# Altium project Simple_EEM_Controller.PrjPCB (part 3 of 5)

## Sheet Connector_SOM240_1.SchDoc: =SheetTitle_Top
size 420 x 297 mm; EDA_Number: ARTIQ; Projet: Simple EEM Controller; Author: G.Kasprowicz; CompanyName: WUT ISE; DrawnBy: G.Kasprowicz; Organization: WUT ISE; Address1: PW ISE; Address2: Nowowiejska 15/19 00-665 Warsaw; Address3: gkasprow@gmail.com; Revision: 1.0; ModifiedBy: -; CheckedDate: -; Title2: K24/K26 SOM240_1 Connector; DivGrp: WUT ISE; Designer: G.Kasprowicz; ModifiedDate: -; ProjectName: Sensor Box
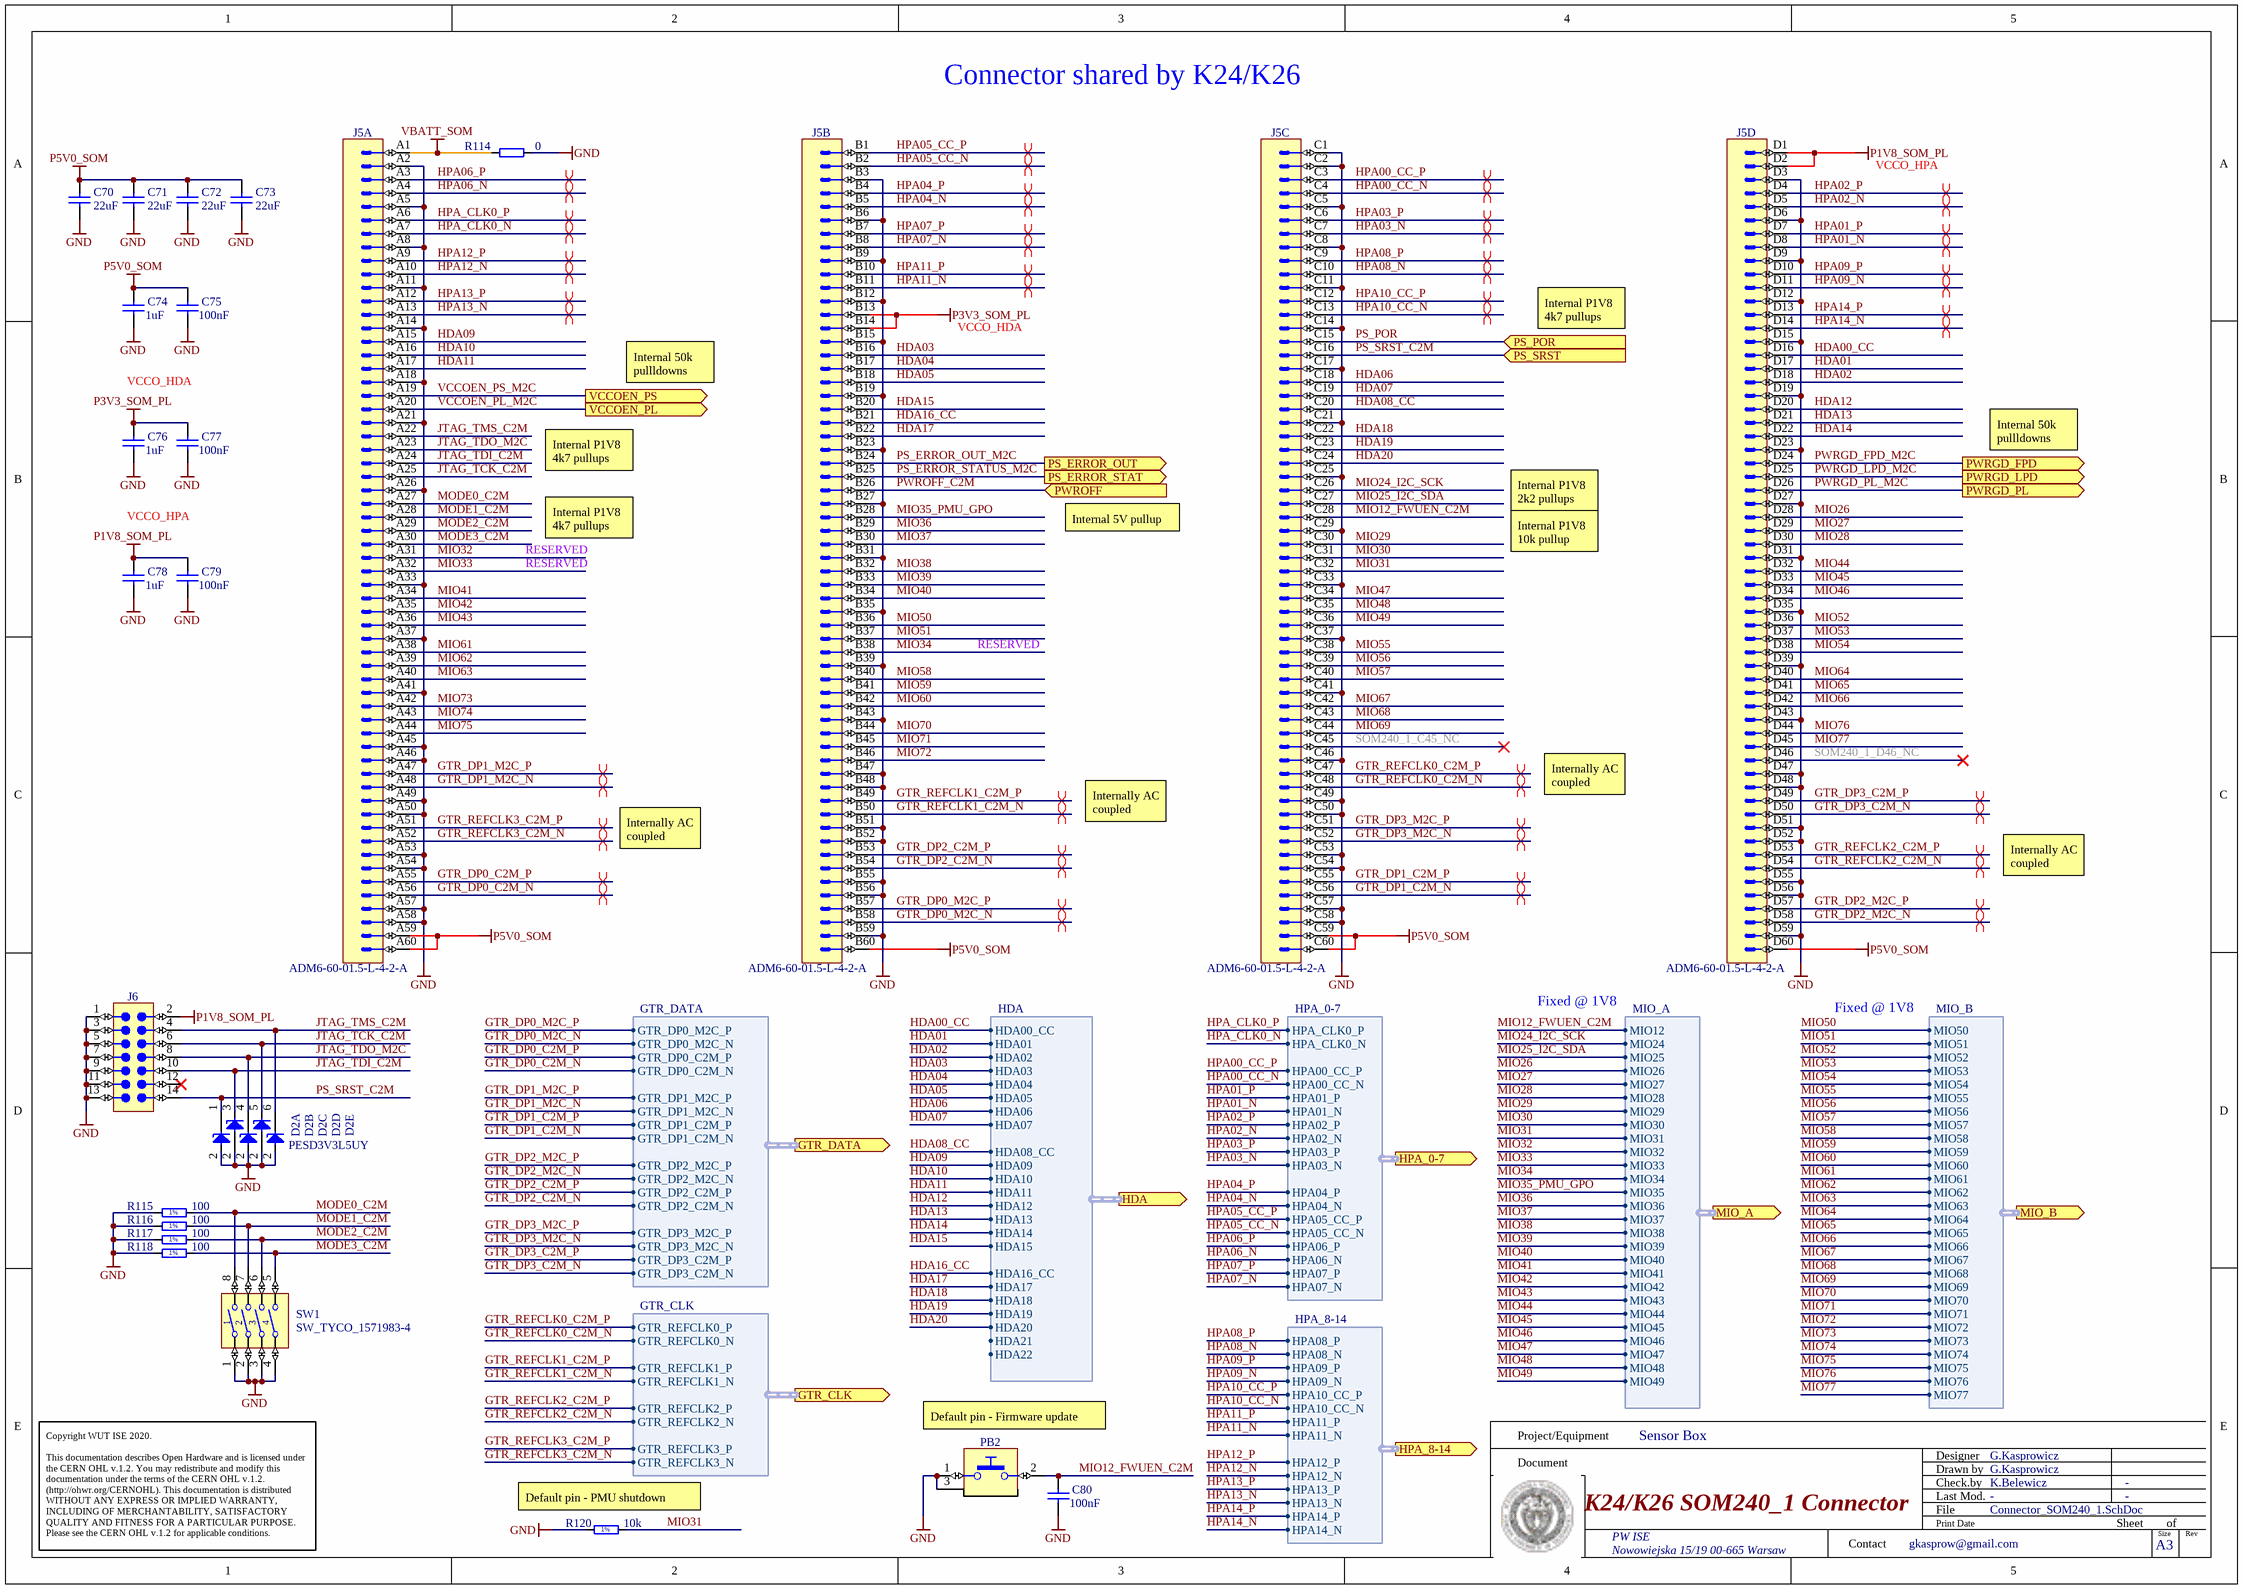
[diagram p5: Connector_SOM240_1.SchDoc]

### Parts
C70  22uF  [CAPC2012X135N]
C71  22uF  [CAPC2012X135N]
C72  22uF  [CAPC2012X135N]
C73  22uF  [CAPC2012X135N]
C74  1uF  [CAPC1005X55N]
C75  100nF  [CAPC1005X55N]
C76  1uF  [CAPC1005X55N]
C77  100nF  [CAPC1005X55N]
C78  1uF  [CAPC1005X55N]
C79  100nF  [CAPC1005X55N]
C80  100nF  [CAPC1005X55N]
D2  PESD3V3L5UY  [SOT65P210X110-6N]  (value not drawn)  (parts A,B,C,D,E of 5)
J5  Manufacturer Part Number: ADM6-60-01.5-L-4-2-A  [SAMTEC_ADM6-60-01.5-L-4-2-A]  (hidden comment: Header 240)  (parts A,B,C,D of 4)
J6  (no value)  [MOLEX_87832-1420]
PB2  (no value)  [PB_OMRON_B3U-1100P]
R114  0  [RESC1005X40N]
R115  100  [RESC1005X40N]
R116  100  [RESC1005X40N]
R117  100  [RESC1005X40N]
R118  100  [RESC1005X40N]
R120  10k  [RESC1005X40N]
SW1  Switch  [SW_TYCO_1571983-4]  (value not drawn)

### Ports
GTR_CLK (out, harness GTR_CLK), GTR_DATA (out, harness GTR_DATA), HDA (out, harness HDA), HPA_0-7 (out, harness HPA_0-7), HPA_8-14 (out, harness HPA_8-14), MIO_A (out, harness MIO_A), MIO_B (out, harness MIO_B), PS_ERROR_OUT (out), PS_ERROR_STAT (out), PS_POR (in), PS_SRST (in), PWRGD_FPD (out), PWRGD_LPD (out), PWRGD_PL (out), PWROFF (in), VCCOEN_PL (out), VCCOEN_PS (out)

### Harnesses
GTR_DATA: GTR_DP0_M2C_P, GTR_DP0_M2C_N, GTR_DP0_C2M_P, GTR_DP0_C2M_N, GTR_DP1_M2C_P, GTR_DP1_M2C_N, GTR_DP1_C2M_P, GTR_DP1_C2M_N, GTR_DP2_M2C_P, GTR_DP2_M2C_N, GTR_DP2_C2M_P, GTR_DP2_C2M_N, GTR_DP3_M2C_P, GTR_DP3_M2C_N, GTR_DP3_C2M_P, GTR_DP3_C2M_N
GTR_CLK: GTR_REFCLK0_P, GTR_REFCLK0_N, GTR_REFCLK1_P, GTR_REFCLK1_N, GTR_REFCLK2_P, GTR_REFCLK2_N, GTR_REFCLK3_P, GTR_REFCLK3_N
HDA: HDA00_CC, HDA01, HDA02, HDA03, HDA04, HDA06, HDA07, HDA05, HDA08_CC, HDA09, HDA10, HDA11, HDA12, HDA13, HDA14, HDA15, HDA16_CC, HDA17, HDA18, HDA19, HDA20, HDA21, HDA22
HPA_0-7: HPA_CLK0_P, HPA_CLK0_N, HPA00_CC_P, HPA00_CC_N, HPA01_P, HPA01_N, HPA02_P, HPA02_N, HPA03_P, HPA03_N, HPA04_P, HPA04_N, HPA05_CC_P, HPA05_CC_N, HPA06_P, HPA06_N, HPA07_P, HPA07_N
HPA_8-14: HPA08_P, HPA08_N, HPA09_P, HPA09_N, HPA10_CC_P, HPA10_CC_N, HPA11_P, HPA11_N, HPA12_P, HPA12_N, HPA13_P, HPA13_N, HPA14_P, HPA14_N
MIO_A: MIO12, MIO24, MIO25, MIO26, MIO27, MIO28, MIO29, MIO30, MIO31, MIO32, MIO33, MIO34, MIO35, MIO36, MIO37, MIO38, MIO39, MIO40, MIO41, MIO42, MIO43, MIO44, MIO45, MIO46, MIO47, MIO48, MIO49
MIO_B: MIO50, MIO51, MIO52, MIO53, MIO54, MIO55, MIO56, MIO57, MIO58, MIO59, MIO60, MIO61, MIO62, MIO63, MIO64, MIO65, MIO66, MIO67, MIO68, MIO69, MIO70, MIO71, MIO72, MIO73, MIO74, MIO75, MIO76, MIO77

### Nets
GND: C70.1 C71.1 C72.1 C73.1 C74.1 C75.1 C76.1 C77.1 C78.1 C79.1 C80.1 D2.2(A) J5.A2 J5.A5 J5.A8 J5.A11 J5.A14 J5.A18 J5.A21 J5.A26 J5.A33 J5.A37 J5.A41 J5.A45 J5.A46 J5.A49 J5.A50 J5.A53 J5.A54 J5.A57 J5.A58 J5.B3 J5.B6 J5.B9 J5.B12 J5.B15 J5.B19 J5.B23 J5.B27 J5.B31 J5.B35 J5.B39 J5.B43 J5.B47 J5.B48 J5.B51 J5.B52 J5.B55 J5.B56 J5.B59 J5.C1 J5.C2 J5.C5 J5.C8 J5.C11 J5.C14 J5.C17 J5.C21 J5.C25 J5.C29 J5.C33 J5.C37 J5.C41 J5.C46 J5.C49 J5.C50 J5.C53 J5.C54 J5.C57 J5.C58 J5.D3 J5.D6 J5.D9 J5.D12 J5.D15 J5.D19 J5.D23 J5.D27 J5.D31 J5.D35 J5.D39 J5.D43 J5.D47 J5.D48 J5.D51 J5.D52 J5.D55 J5.D56 J5.D59 J6.1 J6.3 J6.5 J6.7 J6.9 J6.11 J6.13 PB2.1 PB2.3 R114.2 R115.1 R116.1 R117.1 R118.1 R120.1 SW1.1 SW1.2 SW1.3 SW1.4
P1V8_SOM_PL: C78.2 C79.2 J5.D1 J5.D2 J6.2
P3V3_SOM_PL: C76.2 C77.2 J5.B13 J5.B14
P5V0_SOM: C70.2 C71.2 C72.2 C73.2 C74.2 C75.2 J5.A59 J5.A60 J5.B60 J5.C59 J5.C60 J5.D60
VBATT_SOM: J5.A1 R114.1
GTR_DP0_C2M_N: J5.A56 ; port GTR_DATA.GTR_DP0_C2M_N
GTR_DP0_C2M_P: J5.A55 ; port GTR_DATA.GTR_DP0_C2M_P
GTR_DP0_M2C_N: J5.B58 ; port GTR_DATA.GTR_DP0_M2C_N
GTR_DP0_M2C_P: J5.B57 ; port GTR_DATA.GTR_DP0_M2C_P
GTR_DP1_C2M_N: J5.C56 ; port GTR_DATA.GTR_DP1_C2M_N
GTR_DP1_C2M_P: J5.C55 ; port GTR_DATA.GTR_DP1_C2M_P
GTR_DP1_M2C_N: J5.A48 ; port GTR_DATA.GTR_DP1_M2C_N
GTR_DP1_M2C_P: J5.A47 ; port GTR_DATA.GTR_DP1_M2C_P
GTR_DP2_C2M_N: J5.B54 ; port GTR_DATA.GTR_DP2_C2M_N
GTR_DP2_C2M_P: J5.B53 ; port GTR_DATA.GTR_DP2_C2M_P
GTR_DP2_M2C_N: J5.D58 ; port GTR_DATA.GTR_DP2_M2C_N
GTR_DP2_M2C_P: J5.D57 ; port GTR_DATA.GTR_DP2_M2C_P
GTR_DP3_C2M_N: J5.D50 ; port GTR_DATA.GTR_DP3_C2M_N
GTR_DP3_C2M_P: J5.D49 ; port GTR_DATA.GTR_DP3_C2M_P
GTR_DP3_M2C_N: J5.C52 ; port GTR_DATA.GTR_DP3_M2C_N
GTR_DP3_M2C_P: J5.C51 ; port GTR_DATA.GTR_DP3_M2C_P
GTR_REFCLK0_C2M_N: J5.C48 ; port GTR_CLK.GTR_REFCLK0_N
GTR_REFCLK0_C2M_P: J5.C47 ; port GTR_CLK.GTR_REFCLK0_P
GTR_REFCLK1_C2M_N: J5.B50 ; port GTR_CLK.GTR_REFCLK1_N
GTR_REFCLK1_C2M_P: J5.B49 ; port GTR_CLK.GTR_REFCLK1_P
GTR_REFCLK2_C2M_N: J5.D54 ; port GTR_CLK.GTR_REFCLK2_N
GTR_REFCLK2_C2M_P: J5.D53 ; port GTR_CLK.GTR_REFCLK2_P
GTR_REFCLK3_C2M_N: J5.A52 ; port GTR_CLK.GTR_REFCLK3_N
GTR_REFCLK3_C2M_P: J5.A51 ; port GTR_CLK.GTR_REFCLK3_P
HDA00_CC: J5.D16 ; port HDA.HDA00_CC  [project net HDA.HDA00_CC]
HDA01: J5.D17 ; port HDA.HDA01  [project net HDA.HDA01]
HDA02: J5.D18 ; port HDA.HDA02  [project net HDA.HDA02]
HDA03: J5.B16 ; port HDA.HDA03  [project net HDA.HDA03]
HDA04: J5.B17 ; port HDA.HDA04  [project net HDA.HDA04]
HDA05: J5.B18 ; port HDA.HDA05  [project net HDA.HDA05]
HDA06: J5.C18 ; port HDA.HDA06  [project net HDA.HDA06]
HDA07: J5.C19 ; port HDA.HDA07  [project net HDA.HDA07]
HDA08_CC: J5.C20 ; port HDA.HDA08_CC  [project net HDA.HDA08_CC]
HDA09: J5.A15 ; port HDA.HDA09  [project net HDA.HDA09]
HDA10: J5.A16 ; port HDA.HDA10  [project net HDA.HDA10]
HDA11: J5.A17 ; port HDA.HDA11  [project net HDA.HDA11]
HDA12: J5.D20 ; port HDA.HDA12  [project net HDA.HDA12]
HDA13: J5.D21 ; port HDA.HDA13  [project net HDA.HDA13]
HDA14: J5.D22 ; port HDA.HDA14  [project net HDA.HDA14]
HDA15: J5.B20 ; port HDA.HDA15  [project net HDA.HDA15]
HDA16_CC: J5.B21 ; port HDA.HDA16_CC  [project net HDA.HDA16_CC]
HDA17: J5.B22 ; port HDA.HDA17  [project net EXT_I2C.RESET]
HDA18: J5.C22 ; port HDA.HDA18  [project net EXT_I2C.SDA]
HDA19: J5.C23 ; port HDA.HDA19  [project net EXT_I2C.SCL]
HDA20: J5.C24 ; port HDA.HDA20  [project net HDA.HDA20]
HPA00_CC_N: J5.C4 ; port HPA_0-7.HPA00_CC_N  [project net EXT0.LVDS_N0]
HPA00_CC_P: J5.C3 ; port HPA_0-7.HPA00_CC_P  [project net EXT0.LVDS_P0]
HPA01_N: J5.D8 ; port HPA_0-7.HPA01_N  [project net EXT0.LVDS_N1]
HPA01_P: J5.D7 ; port HPA_0-7.HPA01_P  [project net EXT0.LVDS_P1]
HPA02_N: J5.D5 ; port HPA_0-7.HPA02_N  [project net EXT0.LVDS_N2]
HPA02_P: J5.D4 ; port HPA_0-7.HPA02_P  [project net EXT0.LVDS_P2]
HPA03_N: J5.C7 ; port HPA_0-7.HPA03_N  [project net EXT0.LVDS_N3]
HPA03_P: J5.C6 ; port HPA_0-7.HPA03_P  [project net EXT0.LVDS_P3]
HPA04_N: J5.B5 ; port HPA_0-7.HPA04_N  [project net EXT0.LVDS_N4]
HPA04_P: J5.B4 ; port HPA_0-7.HPA04_P  [project net EXT0.LVDS_P4]
HPA05_CC_N: J5.B2 ; port HPA_0-7.HPA05_CC_N  [project net EXT0.LVDS_N5]
HPA05_CC_P: J5.B1 ; port HPA_0-7.HPA05_CC_P  [project net EXT0.LVDS_P5]
HPA06_N: J5.A4 ; port HPA_0-7.HPA06_N  [project net EXT0.LVDS_N6]
HPA06_P: J5.A3 ; port HPA_0-7.HPA06_P  [project net EXT0.LVDS_P6]
HPA07_N: J5.B8 ; port HPA_0-7.HPA07_N  [project net EXT0.LVDS_N7]
HPA07_P: J5.B7 ; port HPA_0-7.HPA07_P  [project net EXT0.LVDS_P7]
HPA08_N: J5.C10 ; port HPA_8-14.HPA08_N  [project net EXT1.LVDS_N1]
HPA08_P: J5.C9 ; port HPA_8-14.HPA08_P  [project net EXT1.LVDS_P1]
HPA09_N: J5.D11 ; port HPA_8-14.HPA09_N  [project net EXT1.LVDS_N2]
HPA09_P: J5.D10 ; port HPA_8-14.HPA09_P  [project net EXT1.LVDS_P2]
HPA10_CC_N: J5.C13 ; port HPA_8-14.HPA10_CC_N  [project net EXT1.LVDS_N0]
HPA10_CC_P: J5.C12 ; port HPA_8-14.HPA10_CC_P  [project net EXT1.LVDS_P0]
HPA11_N: J5.B11 ; port HPA_8-14.HPA11_N  [project net FPGA_CLK_OUT_N]
HPA11_P: J5.B10 ; port HPA_8-14.HPA11_P  [project net FPGA_CLK_OUT_P]
HPA12_N: J5.A10 ; port HPA_8-14.HPA12_N  [project net EXT1.LVDS_N3]
HPA12_P: J5.A9 ; port HPA_8-14.HPA12_P  [project net EXT1.LVDS_P3]
HPA13_N: J5.A13 ; port HPA_8-14.HPA13_N  [project net EXT1.LVDS_N4]
HPA13_P: J5.A12 ; port HPA_8-14.HPA13_P  [project net EXT1.LVDS_P4]
HPA14_N: J5.D14 ; port HPA_8-14.HPA14_N  [project net EXT1.LVDS_N5]
HPA14_P: J5.D13 ; port HPA_8-14.HPA14_P  [project net EXT1.LVDS_P5]
HPA_CLK0_N: J5.A7 ; port HPA_0-7.HPA_CLK0_N  [project net FPGA_PL_CLKREF_N]
HPA_CLK0_P: J5.A6 ; port HPA_0-7.HPA_CLK0_P  [project net FPGA_PL_CLKREF_P]
JTAG_TCK_C2M: D2.5(C) J5.A25 J6.6
JTAG_TDI_C2M: D2.3(C) J5.A24 J6.10
JTAG_TDO_M2C: D2.4(C) J5.A23 J6.8
JTAG_TMS_C2M: D2.6(C) J5.A22 J6.4
MIO12_FWUEN_C2M: C80.2 J5.C28 PB2.2 ; port MIO_A.MIO12
MIO24_I2C_SCK: J5.C26 ; port MIO_A.MIO24
MIO25_I2C_SDA: J5.C27 ; port MIO_A.MIO25
MIO26: J5.D28 ; port MIO_A.MIO26
MIO27: J5.D29 ; port MIO_A.MIO27
MIO28: J5.D30 ; port MIO_A.MIO28
MIO29: J5.C30 ; port MIO_A.MIO29
MIO30: J5.C31 ; port MIO_A.MIO30
MIO31: J5.C32 R120.2 ; port MIO_A.MIO31
MIO32: J5.A31 ; port MIO_A.MIO32
MIO33: J5.A32 ; port MIO_A.MIO33
MIO34: J5.B38 ; port MIO_A.MIO34
MIO35_PMU_GPO: J5.B28 ; port MIO_A.MIO35
MIO36: J5.B29 ; port MIO_A.MIO36
MIO37: J5.B30 ; port MIO_A.MIO37
MIO38: J5.B32 ; port MIO_A.MIO38
MIO39: J5.B33 ; port MIO_A.MIO39
MIO40: J5.B34 ; port MIO_A.MIO40
MIO41: J5.A34 ; port MIO_A.MIO41
MIO42: J5.A35 ; port MIO_A.MIO42
MIO43: J5.A36 ; port MIO_A.MIO43
MIO44: J5.D32 ; port MIO_A.MIO44
MIO45: J5.D33 ; port MIO_A.MIO45
MIO46: J5.D34 ; port MIO_A.MIO46
MIO47: J5.C34 ; port MIO_A.MIO47
MIO48: J5.C35 ; port MIO_A.MIO48
MIO49: J5.C36 ; port MIO_A.MIO49
MIO50: J5.B36 ; port MIO_B.MIO50
MIO51: J5.B37 ; port MIO_B.MIO51
MIO52: J5.D36 ; port MIO_B.MIO52  [project net ETH_MDIO]
MIO53: J5.D37 ; port MIO_B.MIO53  [project net ETH_MDC]
MIO54: J5.D38 ; port MIO_B.MIO54
MIO55: J5.C38 ; port MIO_B.MIO55
MIO56: J5.C39 ; port MIO_B.MIO56  [project net ETH_RXD0]
MIO57: J5.C40 ; port MIO_B.MIO57
MIO58: J5.B40 ; port MIO_B.MIO58
MIO59: J5.B41 ; port MIO_B.MIO59
MIO60: J5.B42 ; port MIO_B.MIO60
MIO61: J5.A38 ; port MIO_B.MIO61
MIO62: J5.A39 ; port MIO_B.MIO62
MIO63: J5.A40 ; port MIO_B.MIO63
MIO64: J5.D40 ; port MIO_B.MIO64
MIO65: J5.D41 ; port MIO_B.MIO65  [project net ETH_RX_CLK]
MIO66: J5.D42 ; port MIO_B.MIO66  [project net ETH_RXD1]
MIO67: J5.C42 ; port MIO_B.MIO67
MIO68: J5.C43 ; port MIO_B.MIO68
MIO69: J5.C44 ; port MIO_B.MIO69
MIO70: J5.B44 ; port MIO_B.MIO70  [project net ETH_RXD2]
MIO71: J5.B45 ; port MIO_B.MIO71
MIO72: J5.B46 ; port MIO_B.MIO72
MIO73: J5.A42 ; port MIO_B.MIO73
MIO74: J5.A43 ; port MIO_B.MIO74
MIO75: J5.A44 ; port MIO_B.MIO75
MIO76: J5.D44 ; port MIO_B.MIO76  [project net ETH_RXD3]
MIO77: J5.D45 ; port MIO_B.MIO77  [project net ETH_RX_CTL]
MODE0_C2M: J5.A27 R115.2 SW1.8
MODE1_C2M: J5.A28 R116.2 SW1.7
MODE2_C2M: J5.A29 R117.2 SW1.6
MODE3_C2M: J5.A30 R118.2 SW1.5
PS_ERROR_OUT_M2C: J5.B24 ; port PS_ERROR_OUT
PS_ERROR_STATUS_M2C: J5.B25 ; port PS_ERROR_STAT
PS_POR: J5.C15 ; port PS_POR
PS_SRST_C2M: D2.1(C) J5.C16 J6.14 ; port PS_SRST
PWRGD_FPD_M2C: J5.D24 ; port PWRGD_FPD
PWRGD_LPD_M2C: J5.D25 ; port PWRGD_LPD
PWRGD_PL_M2C: J5.D26 ; port PWRGD_PL
PWROFF_C2M: J5.B26 ; port PWROFF
SOM240_1_C45_NC: J5.C45
SOM240_1_D46_NC: J5.D46
VCCOEN_PL_M2C: J5.A20 ; port VCCOEN_PL
VCCOEN_PS_M2C: J5.A19 ; port VCCOEN_PS

Not connected (* = marked no-connect by the designer): J6 12*

### Layout directives
differential pair; differential pair class Diff_GTR: GTR_DP0_C2M_N, GTR_DP0_C2M_P, GTR_DP0_M2C_N, GTR_DP0_M2C_P, GTR_DP1_C2M_N, GTR_DP1_C2M_P, GTR_DP1_M2C_N, GTR_DP1_M2C_P, GTR_DP2_C2M_N, GTR_DP2_C2M_P, GTR_DP2_M2C_N, GTR_DP2_M2C_P, GTR_DP3_C2M_N, GTR_DP3_C2M_P, GTR_DP3_M2C_N, GTR_DP3_M2C_P, GTR_REFCLK0_C2M_N, GTR_REFCLK0_C2M_P, GTR_REFCLK1_C2M_N, GTR_REFCLK1_C2M_P, GTR_REFCLK2_C2M_N, GTR_REFCLK2_C2M_P, GTR_REFCLK3_C2M_N, GTR_REFCLK3_C2M_P
differential pair; differential pair class Diff_HPA: EXT0.LVDS_N0, EXT0.LVDS_N1, EXT0.LVDS_N2, EXT0.LVDS_N3, EXT0.LVDS_N4, EXT0.LVDS_N5, EXT0.LVDS_N6, EXT0.LVDS_N7, EXT0.LVDS_P0, EXT0.LVDS_P1, EXT0.LVDS_P2, EXT0.LVDS_P3, EXT0.LVDS_P4, EXT0.LVDS_P5, EXT0.LVDS_P6, EXT0.LVDS_P7, EXT1.LVDS_N0, EXT1.LVDS_N1, EXT1.LVDS_N2, EXT1.LVDS_N3, EXT1.LVDS_N4, EXT1.LVDS_N5, EXT1.LVDS_P0, EXT1.LVDS_P1, EXT1.LVDS_P2, EXT1.LVDS_P3, EXT1.LVDS_P4, EXT1.LVDS_P5, FPGA_CLK_OUT_N, FPGA_CLK_OUT_P, FPGA_PL_CLKREF_N, FPGA_PL_CLKREF_P

### Notes on the sheet
- Connector shared by K24/K26
- VCCO_HPA
- Internal P1V8 4k7 pullups
- VCCO_HDA
- Internal 50k pullldowns
- Internal 5V pullup
- Internal P1V8 2k2 pullups
- RESERVED
- Internal P1V8 10k pullup
- Internally AC coupled
- Fixed @ 1V8
- Default pin - Firmware update
- (near R120) Default pin - PMU shutdown
- Project/Equipment
- Document
- Designer
- Drawn by
- Check.by
- Copyright WUT ISE 2020.
  This documentation describes Open Hardware and is licensed under the CERN OHL v.1.2. You may redistribute and modify this documentation under the terms of the CERN OHL v.1.2. (http://ohwr.org/CERNOHL). This documentation is distributed WITHOUT ANY EXPRESS OR IMPLIED WARRANTY, INCLUDING OF MERCHANTABILITY, SATISFACTORY QUALITY AND FITNESS FOR A PARTICULAR PURPOSE. Please see the CERN OHL v.1.2 for applicable conditions.
- Contact
- File
- Last Mod.
- Print Date
- Sheet
- Size
- A3
- of
- Rev
- (in symbol R0402_10K_1%_0.0625W_100PPM) 1%
- (in symbol R0402_100R_1%_0.0625W_100PPM) 1%

### Library data of the parts
C70-C73 = CC0805_22UF_16V_10%_X5R: Non-polarised capacitor; Part Description: SMD Multilayer Chip Ceramic Capacitor; Manufacturer: GENERIC; Manufacturer1 Part Number: C2012X5R1C226KT; Voltage: 16V; TC: X5R; Tolerance: ±10%; Part Number: CC0805_22UF_16V_10%_X5R; Component Kind: Standard; Component Type: Standard; Pin Count: 2; Value: 22uF; Status: Preferred; Manufacturer Part Number: CC0805_22UF_16V_10%_X5R; Case: 0805; Mounted: Yes; Socket: No; SMD: Yes; Sense: No; Manufacturer1 Example: TDK; Manufacturer1 ComponentHeight: 1.35mm; HelpURL: \\cern.ch\dfs\Applications\Altium\Datasheets\CC0805_X5R_TDK_C.pdf; Author: CERN DEM JLC; CreateDate: 25.10.2012; LatestRevisionDate: 25.10.2012
C74 C76 C78 = CC0402_1UF_16V_10%_X5R: Non-polarised capacitor; Part Description: SMD Multilayer Chip Ceramic Capacitor; Manufacturer: GENERIC; Manufacturer1 Part Number: C1005X5R1C105KT; Voltage: 16V; TC: X5R; Tolerance: ±10%; Part Number: CC0402_1UF_16V_10%_X5R; Component Kind: Standard; Component Type: Standard; Pin Count: 2; Value: 1uF; Status: Preferred; Manufacturer Part Number: CC0402_1UF_16V_10%_X5R; Case: 0402; Mounted: Yes; Socket: No; SMD: Yes; Sense: No; Manufacturer1 Example: TDK; Manufacturer1 ComponentHeight: 0.55mm; HelpURL: \\cern.ch\dfs\Applications\Altium\Datasheets\CC0402_X5R_TDK_C.pdf; Author: CERN DEM JLC; CreateDate: 2012-10-25; LatestRevisionDate: 2012-10-25
C75 C77 C79 C80 = CC0402_100NF_16V_10%_X5R: Non-polarised capacitor; Part Description: SMD Multilayer Chip Ceramic Capacitor; Manufacturer: GENERIC; Manufacturer1 Part Number: GRM155R61C104KA88D; Voltage: 16V; TC: X5R; Tolerance: ±10%; Part Number: CC0402_100NF_16V_10%_X5R; Component Kind: Standard; Component Type: Standard; Pin Count: 2; Value: 100nF; Status: None; Manufacturer Part Number: CC0402_100NF_16V_10%_X5R; Case: 0402; Mounted: Yes; Socket: No; SMD: Yes; Sense: No; Manufacturer1 Example: MURATA; Manufacturer1 ComponentHeight: 0.55mm; HelpURL: \\cern.ch\dfs\Applications\Altium\Datasheets\CC0402_X5R_MURATA_GRM.pdf; Author: CERN DEM JLC; CreateDate: 10.12.2013; LatestRevisionDate: 10.12.2013
D2 = PESD3V3L5UY: Fivefold ESD Protection Diode Arrays; Part Description: Fivefold ESD Protection Diode Arrays (30kV); Manufacturer: NEXPERIA; Voltage: 3.3V; Power: 200W; PressFit: No; Bonding: No; Part Number: PESD3V3L5UY; Component Kind: Standard; Component Type: Standard; Device: PESD3V3L5UY; PackageDescription: SOT363, SC-88, 0.65mm Pitch; 6 Pin, 1.25mm W X 2.00mm L X 1.10mm H body, IPC Medium Density; Manufacturer Part Number: PESD3V3L5UY; Pin Count: 6; Case: SOT363; Mounted: Yes; Socket: No; SMD: Yes; Sense: No; ComponentHeight: 1.1mm; HelpURL: \\cern.ch\dfs\Applications\Altium\Datasheets\PESD3V3L5UY.pdf; Author: CERN DEM WB; CreateDate: 05.07.2021; LatestRevisionDate: 05.07.2021
J5 = SAMTEC_ADM6-60-01.5-L-4-2-A: Connector 240 Male contacts in 4 row abcd; Part Description: 240 contacts (4 rows abcd) High-Density  Slim Body Arrays Male Connector; Manufacturer: SAMTEC; PressFit: No; Part Number: SAMTEC_ADM6-60-01.5-L-4-2-A; Component Kind: Standard; Component Type: Standard; Pin Count: 240; Family: Header 240; Mounted: Yes; Socket: No; SMD: Yes; Sense: No; Status: None; ComponentHeight: 4.1mm; HelpURL: \\cern.ch\dfs\Applications\Altium\Datasheets\SAMTEC_ADM6-60-01.5-L-4-2-A.pdf; Author: CERN DEM HF; CreateDate: 27/10/2021; LatestRevisionDate: 11/01/2022
J6 = MOLEX_87832-1420: Connector 14 Male; Part Description: 2.00mm (.079") Pitch Milli-Grid™ Header, Surface Mount, Vertical, Shrouded, 14 Circuits, with Locking Windows and Centre Polarization Slot, PCB Locator; Manufacturer: MOLEX; PressFit: No; Part Number: MOLEX_87832-1420; Component Kind: Standard; Component Type: Standard; Pin Count: 14; Family: Milli-Grid™; Mounted: Yes; Socket: No; SMD: Yes; Manufacturer Part Number: 87832-1420; ComponentHeight: 7.6mm; HelpURL: \\cern.ch\dfs\Applications\Altium\Datasheets\MOLEX_87832-1420.pdf; Author: CERN DEM JLC; CreateDate: 9/9/2008; LatestRevisionDate: 9/9/2008; Table: MOLEX; Status: None; Supplier: Radiospares; SupplierRef: 6701071; Sense: No
PB2 = PB_OMRON_B3U-1100P: Push-Button Switch SPDT; Part Description: 3x2.5mm Ultra-Small Tactile SPST Pushbutton Switch (with Ground Terminal),Contact Rating 50mA 12VDC, B3U Series; Manufacturer: OMRON; PressFit: No; Part Number: PB_OMRON_B3U-1100P; Component Kind: Standard; Component Type: Standard; Pin Count: 3; PackageDescription: Body 1.2x3x2.5mm Ultra-Small Tactile SPST Pushbutton Switch, (with Ground Terminal), OMRON B3U Series; Family: Push Button; Mounted: Yes; Socket: No; SMD: Yes; Sense: No; Status: None; Manufacturer Part Number: B3U-1100P; ComponentHeight: 1.75mm; HelpURL: \\cern.ch\dfs\Applications\Altium\Datasheets\PB_OMRON_B3U-1100P.pdf; Author: CERN DEM JLC; CreateDate: 3/16/2010; LatestRevisionDate: 6/16/2022
R114 = R0402_0R_JUMPER: Resistor; Part Description: 1A (0.05R Max DC Resistance) Zero Ohm Jumper; Manufacturer: GENERIC; Manufacturer1 Part Number: 232270591001L; PressFit: No; Part Number: R0402_0R_JUMPER; Component Kind: Standard; Component Type: Standard; Pin Count: 2; Value: 0; Status: Not Recommended; Manufacturer Part Number: R0402_0R_JUMPER; Case: 0402; Mounted: Yes; Sense: No; Socket: No; SMD: Yes; Manufacturer1 Example: YAGEO PHYCOMP; Manufacturer1 ComponentHeight: 0.4mm; HelpURL: \\cern.ch\dfs\Applications\Altium\Datasheets\R0402_Phycomp_RC0402.pdf; Author: CERN DEM JLC; CreateDate: 03.12.2007; LatestRevisionDate: 17.10.2012
R115-R118 = R0402_100R_1%_0.0625W_100PPM: Resistor - 1%; Part Description: General Purpose Thick Film Chip Resistor; Manufacturer: GENERIC; Manufacturer1 Part Number: 232270671001L; TC: ±100ppm/°C; PressFit: No; Mounted: No; Part Number: R0402_100R_1%_0.0625W_100PPM; Component Kind: Standard; Component Type: Standard; Pin Count: 2; Value: 100; Status: Not Recommended; Power: 0.0625W; Tolerance: ±1%; Manufacturer Part Number: R0402_100R_1%_0.0625W_100PPM; Case: 0402; Sense: No; Socket: No; SMD: Yes; Manufacturer1 Example: YAGEO PHYCOMP; Manufacturer1 ComponentHeight: 0.4mm; HelpURL: \\cern.ch\dfs\Applications\Altium\Datasheets\R0402_Phycomp_RC0402.pdf; Author: CERN DEM JLC; CreateDate: 03-Dec-07; LatestRevisionDate: 17-Oct-12
R120 = R0402_10K_1%_0.0625W_100PPM: Resistor - 1%; Part Description: General Purpose Thick Film Chip Resistor; Manufacturer: GENERIC; Manufacturer1 Part Number: 232270671003L; TC: ±100ppm/°C; PressFit: No; Part Number: R0402_10K_1%_0.0625W_100PPM; Component Kind: Standard; Component Type: Standard; Pin Count: 2; Value: 10k; Status: Not Recommended; Power: 0.0625W; Tolerance: ±1%; Manufacturer Part Number: R0402_10K_1%_0.0625W_100PPM; Case: 0402; Mounted: Yes; Sense: No; Socket: No; SMD: Yes; Manufacturer1 Example: YAGEO PHYCOMP; Manufacturer1 ComponentHeight: 0.4mm; HelpURL: \\cern.ch\dfs\Applications\Altium\Datasheets\R0402_Phycomp_RC0402.pdf; Author: CERN DEM JLC; CreateDate: 03.12.2007; LatestRevisionDate: 17.10.2012
SW1 = SW_TYCO_1571983-4: 4 Ways SPST DIP Switch; Part Description: 4 Way SPST SMD DIP Switch, Latched, Contact Rating 0.025A 24VDC; Manufacturer: TYCO; Manufacturer Part Number: 1571983-4 or GDH04S04; PressFit: No; Part Number: SW_TYCO_1571983-4; Component Kind: Standard; Component Type: Standard; Pin Count: 8; PackageDescription: Pitch 1.27mm,  Body 6.2x6.2mm, 4 Ways SPST Surface-Mount DIP Switch, TYCO GDH Series; Family: Switch; Mounted: Yes; Socket: No; SMD: Yes; Sense: No; Status: None; ComponentHeight: 2.31mm; HelpURL: \\cern.ch\dfs\Applications\Altium\Datasheets\SW_TYCO_1571983-4.pdf; Author: CERN DEM JLC; CreateDate: 08-Jan-09; LatestRevisionDate: 08-Jan-09

## Sheet Connector_SOM240_2.SchDoc: =SheetTitle_Top
size 420 x 297 mm; EDA_Number: ARTIQ; Projet: Simple EEM Controller; Author: G.Kasprowicz; CompanyName: WUT ISE; DrawnBy: G.Kasprowicz; Organization: WUT ISE; Address1: PW ISE; Address2: Nowowiejska 15/19 00-665 Warsaw; Address3: gkasprow@gmail.com; Revision: 1.0; ModifiedBy: -; CheckedDate: -; Title2: K26 SOM240_2 Connector; DivGrp: WUT ISE; Designer: G.Kasprowicz; ModifiedDate: -; ProjectName: Sensor Box
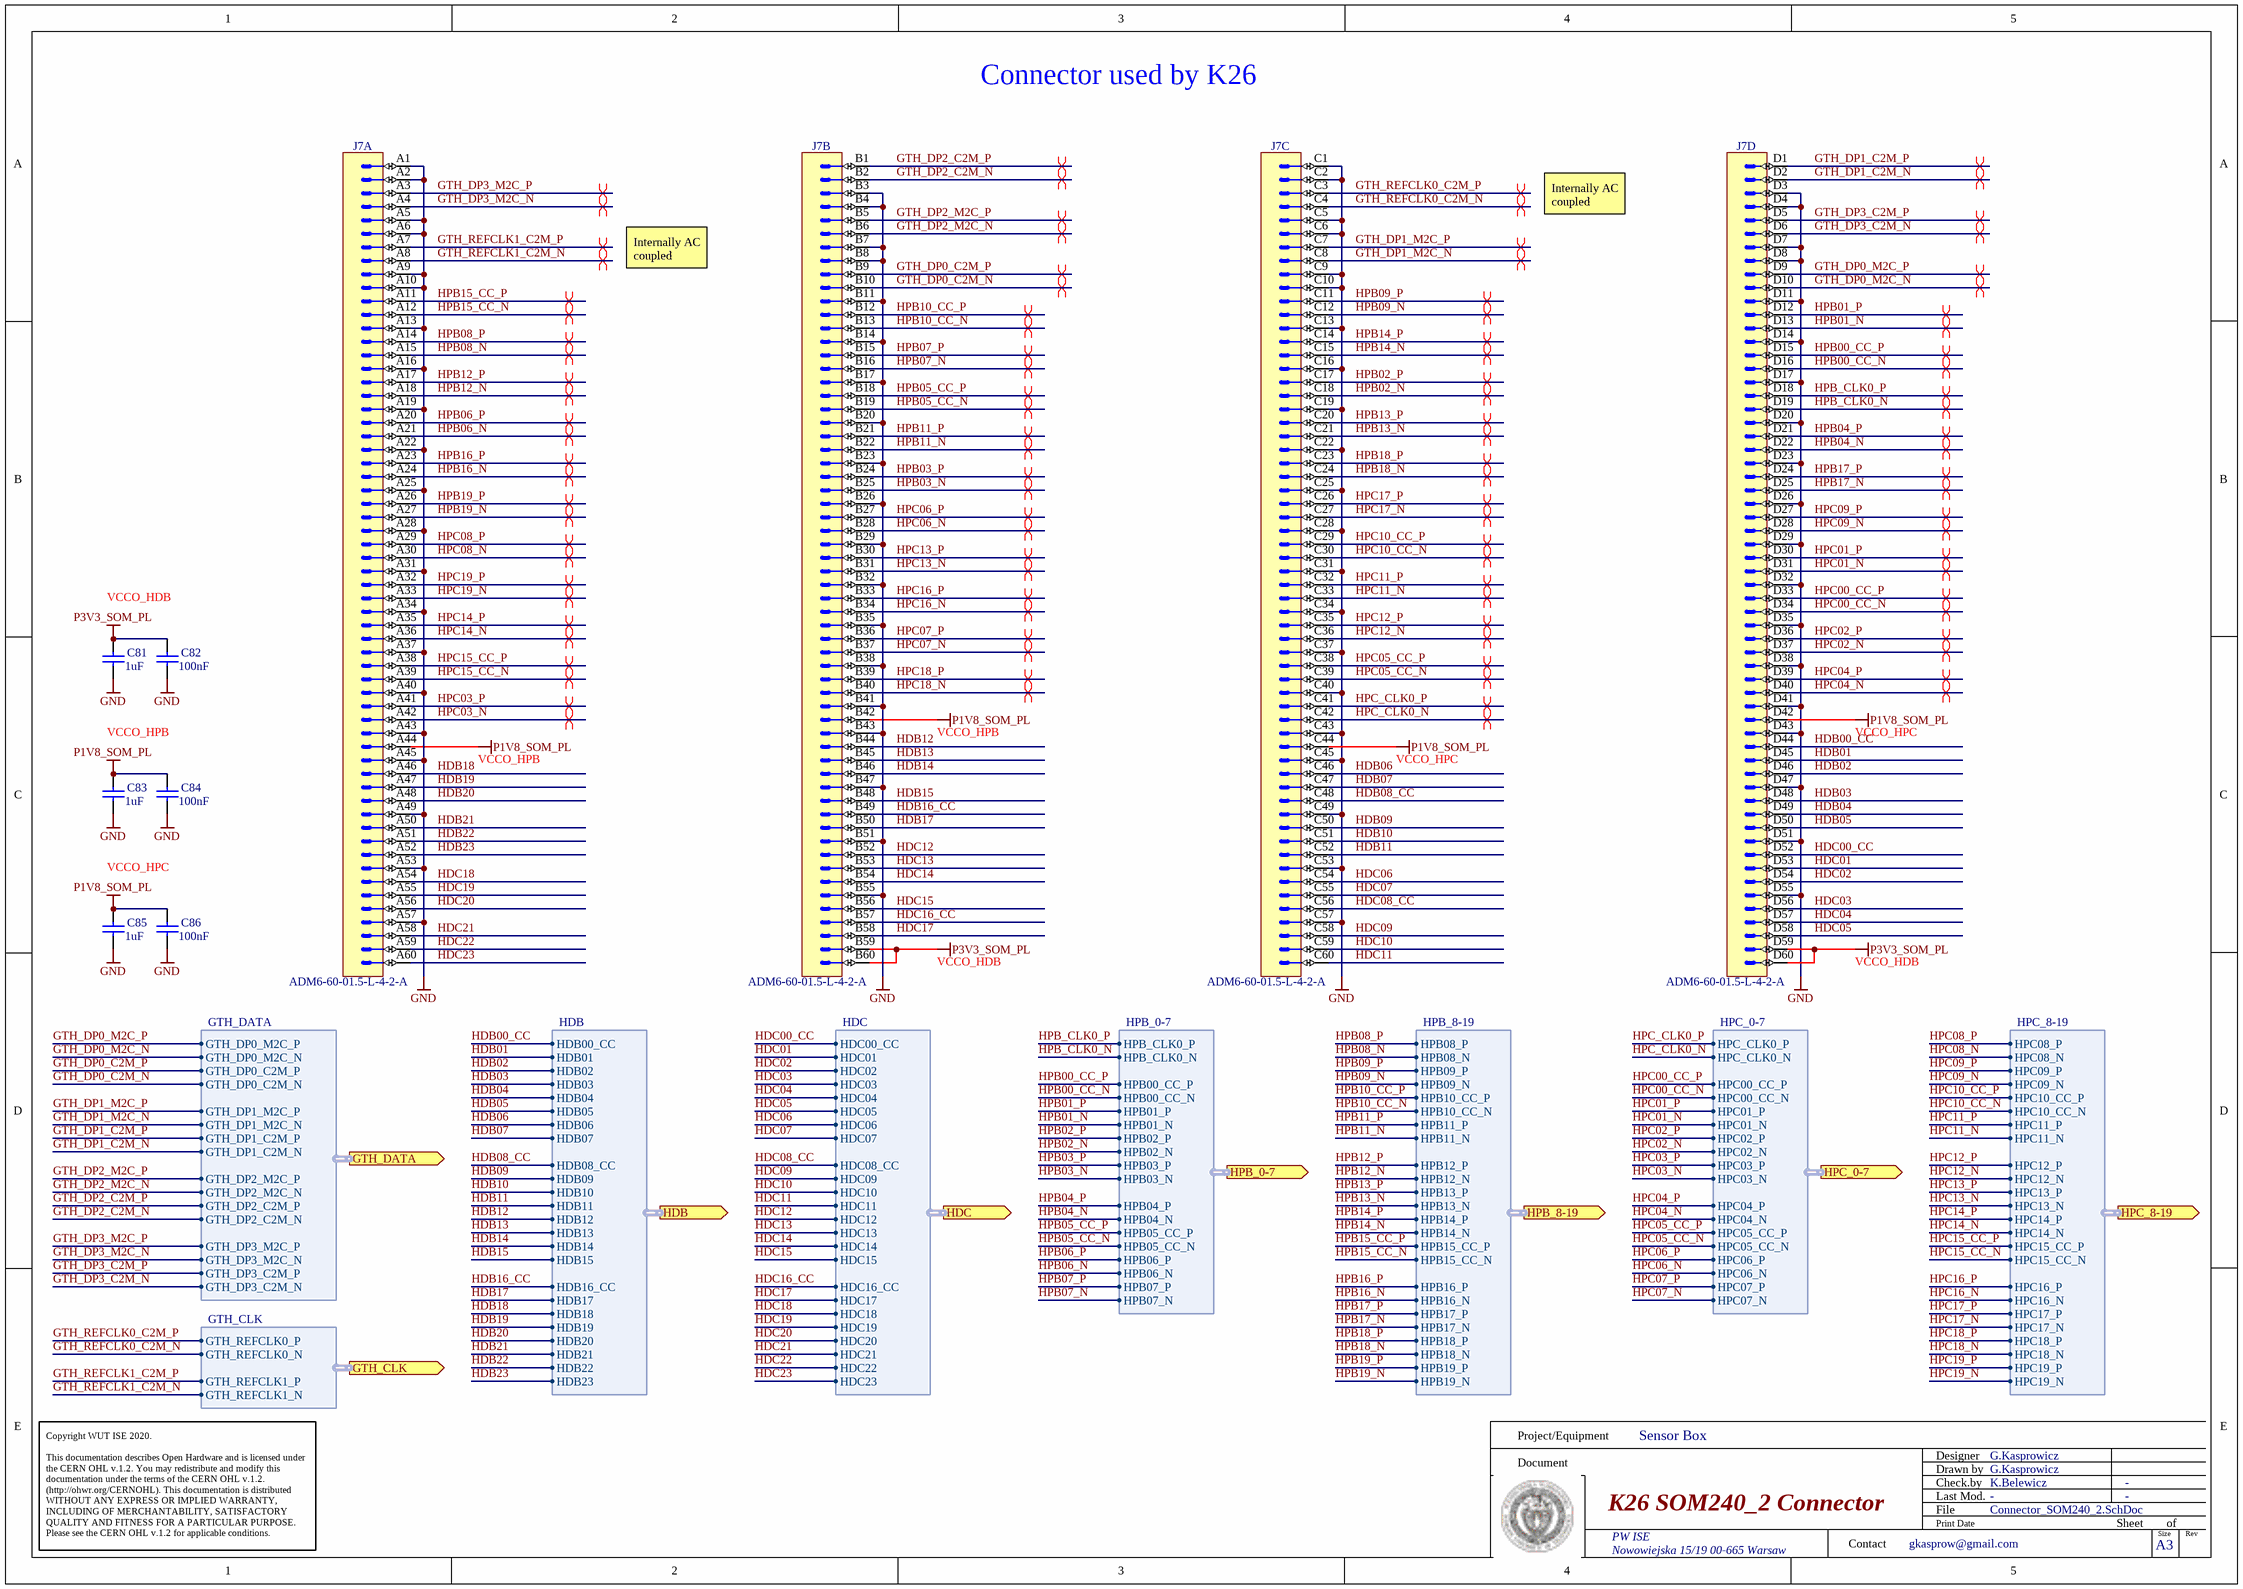
[diagram p6: Connector_SOM240_2.SchDoc]

### Parts
C81  1uF  [CAPC1005X55N]
C82  100nF  [CAPC1005X55N]
C83  1uF  [CAPC1005X55N]
C84  100nF  [CAPC1005X55N]
C85  1uF  [CAPC1005X55N]
C86  100nF  [CAPC1005X55N]
J7  Manufacturer Part Number: ADM6-60-01.5-L-4-2-A  [SAMTEC_ADM6-60-01.5-L-4-2-A]  (hidden comment: Header 240)  (parts A,B,C,D of 4)

### Ports
GTH_CLK (out, harness GTH_CLK), GTH_DATA (out, harness GTH_DATA), HDB (out, harness HDB), HDC (out, harness HDC), HPB_0-7 (out, harness HPB_0-7), HPB_8-19 (out, harness HPB_8-19), HPC_0-7 (out, harness HPC_0-7), HPC_8-19 (out, harness HPC_8-19)

### Harnesses
HDC: HDC00_CC, HDC01, HDC02, HDC03, HDC04, HDC05, HDC06, HDC07, HDC08_CC, HDC09, HDC10, HDC11, HDC12, HDC13, HDC14, HDC15, HDC16_CC, HDC17, HDC18, HDC19, HDC20, HDC21, HDC22, HDC23
HDB: HDB00_CC, HDB01, HDB02, HDB03, HDB04, HDB05, HDB06, HDB07, HDB08_CC, HDB09, HDB10, HDB11, HDB12, HDB13, HDB14, HDB15, HDB16_CC, HDB17, HDB18, HDB19, HDB20, HDB21, HDB22, HDB23
GTH_DATA: GTH_DP0_M2C_P, GTH_DP0_M2C_N, GTH_DP0_C2M_P, GTH_DP0_C2M_N, GTH_DP1_M2C_P, GTH_DP1_M2C_N, GTH_DP1_C2M_P, GTH_DP1_C2M_N, GTH_DP2_M2C_P, GTH_DP2_M2C_N, GTH_DP2_C2M_P, GTH_DP2_C2M_N, GTH_DP3_M2C_P, GTH_DP3_M2C_N, GTH_DP3_C2M_P, GTH_DP3_C2M_N
GTH_CLK: GTH_REFCLK0_P, GTH_REFCLK0_N, GTH_REFCLK1_P, GTH_REFCLK1_N
HPB_0-7: HPB_CLK0_P, HPB_CLK0_N, HPB00_CC_P, HPB00_CC_N, HPB01_P, HPB01_N, HPB02_P, HPB02_N, HPB03_P, HPB03_N, HPB04_P, HPB04_N, HPB05_CC_P, HPB05_CC_N, HPB06_P, HPB06_N, HPB07_P, HPB07_N
HPB_8-19: HPB08_P, HPB08_N, HPB09_P, HPB09_N, HPB10_CC_P, HPB10_CC_N, HPB11_P, HPB11_N, HPB12_P, HPB12_N, HPB13_P, HPB13_N, HPB14_P, HPB14_N, HPB15_CC_P, HPB15_CC_N, HPB16_P, HPB16_N, HPB17_P, HPB17_N, HPB18_P, HPB18_N, HPB19_P, HPB19_N
HPC_0-7: HPC_CLK0_P, HPC_CLK0_N, HPC00_CC_P, HPC00_CC_N, HPC01_P, HPC01_N, HPC02_P, HPC02_N, HPC03_P, HPC03_N, HPC04_P, HPC04_N, HPC05_CC_P, HPC05_CC_N, HPC06_P, HPC06_N, HPC07_P, HPC07_N
HPC_8-19: HPC08_P, HPC08_N, HPC09_P, HPC09_N, HPC10_CC_P, HPC10_CC_N, HPC11_P, HPC11_N, HPC12_P, HPC12_N, HPC13_P, HPC13_N, HPC14_P, HPC14_N, HPC15_CC_P, HPC15_CC_N, HPC16_P, HPC16_N, HPC17_P, HPC17_N, HPC18_P, HPC18_N, HPC19_P, HPC19_N

### Nets
GND: C81.1 C82.1 C83.1 C84.1 C85.1 C86.1 J7.A1 J7.A2 J7.A5 J7.A6 J7.A9 J7.A10 J7.A13 J7.A16 J7.A19 J7.A22 J7.A25 J7.A28 J7.A31 J7.A34 J7.A37 J7.A40 J7.A43 J7.A45 J7.A49 J7.A53 J7.A57 J7.B3 J7.B4 J7.B7 J7.B8 J7.B11 J7.B14 J7.B17 J7.B20 J7.B23 J7.B26 J7.B29 J7.B32 J7.B35 J7.B38 J7.B41 J7.B43 J7.B47 J7.B51 J7.B55 J7.C1 J7.C2 J7.C5 J7.C6 J7.C9 J7.C10 J7.C13 J7.C16 J7.C19 J7.C22 J7.C25 J7.C28 J7.C31 J7.C34 J7.C37 J7.C40 J7.C43 J7.C45 J7.C49 J7.C53 J7.C57 J7.D3 J7.D4 J7.D7 J7.D8 J7.D11 J7.D14 J7.D17 J7.D20 J7.D23 J7.D26 J7.D29 J7.D32 J7.D35 J7.D38 J7.D41 J7.D43 J7.D47 J7.D51 J7.D55
P1V8_SOM_PL: C83.2 C84.2 C85.2 C86.2 J7.A44 J7.B42 J7.C44 J7.D42
P3V3_SOM_PL: C81.2 C82.2 J7.B59 J7.B60 J7.D59 J7.D60
GTH_DP0_C2M_N: J7.B10 ; port GTH_DATA.GTH_DP0_C2M_N  [project net GTH_DATA.GTH_DP0_C2M_N]
GTH_DP0_C2M_P: J7.B9 ; port GTH_DATA.GTH_DP0_C2M_P  [project net GTH_DATA.GTH_DP0_C2M_P]
GTH_DP0_M2C_N: J7.D10 ; port GTH_DATA.GTH_DP0_M2C_N  [project net GTH_DATA.GTH_DP0_M2C_N]
GTH_DP0_M2C_P: J7.D9 ; port GTH_DATA.GTH_DP0_M2C_P  [project net GTH_DATA.GTH_DP0_M2C_P]
GTH_DP1_C2M_N: J7.D2 ; port GTH_DATA.GTH_DP1_C2M_N  [project net GTH_DATA.GTH_DP1_C2M_N]
GTH_DP1_C2M_P: J7.D1 ; port GTH_DATA.GTH_DP1_C2M_P  [project net GTH_DATA.GTH_DP1_C2M_P]
GTH_DP1_M2C_N: J7.C8 ; port GTH_DATA.GTH_DP1_M2C_N  [project net GTH_DATA.GTH_DP1_M2C_N]
GTH_DP1_M2C_P: J7.C7 ; port GTH_DATA.GTH_DP1_M2C_P  [project net GTH_DATA.GTH_DP1_M2C_P]
GTH_DP2_C2M_N: J7.B2 ; port GTH_DATA.GTH_DP2_C2M_N  [project net GTH_DATA.GTH_DP2_C2M_N]
GTH_DP2_C2M_P: J7.B1 ; port GTH_DATA.GTH_DP2_C2M_P  [project net GTH_DATA.GTH_DP2_C2M_P]
GTH_DP2_M2C_N: J7.B6 ; port GTH_DATA.GTH_DP2_M2C_N  [project net GTH_DATA.GTH_DP2_M2C_N]
GTH_DP2_M2C_P: J7.B5 ; port GTH_DATA.GTH_DP2_M2C_P  [project net GTH_DATA.GTH_DP2_M2C_P]
GTH_DP3_C2M_N: J7.D6 ; port GTH_DATA.GTH_DP3_C2M_N  [project net GTH_DATA.GTH_DP3_C2M_N]
GTH_DP3_C2M_P: J7.D5 ; port GTH_DATA.GTH_DP3_C2M_P  [project net GTH_DATA.GTH_DP3_C2M_P]
GTH_DP3_M2C_N: J7.A4 ; port GTH_DATA.GTH_DP3_M2C_N  [project net GTH_DATA.GTH_DP3_M2C_N]
GTH_DP3_M2C_P: J7.A3 ; port GTH_DATA.GTH_DP3_M2C_P  [project net GTH_DATA.GTH_DP3_M2C_P]
GTH_REFCLK0_C2M_N: J7.C4 ; port GTH_CLK.GTH_REFCLK0_N  [project net GTH_CLK.GTH_REFCLK0_N]
GTH_REFCLK0_C2M_P: J7.C3 ; port GTH_CLK.GTH_REFCLK0_P  [project net GTH_CLK.GTH_REFCLK0_P]
GTH_REFCLK1_C2M_N: J7.A8 ; port GTH_CLK.GTH_REFCLK1_N  [project net GTH_CLK.GTH_REFCLK1_N]
GTH_REFCLK1_C2M_P: J7.A7 ; port GTH_CLK.GTH_REFCLK1_P  [project net GTH_CLK.GTH_REFCLK1_P]
HDB00_CC: J7.D44 ; port HDB.HDB00_CC  [project net HDB.HDB00_CC]
HDB01: J7.D45 ; port HDB.HDB01  [project net HDB.HDB01]
HDB02: J7.D46 ; port HDB.HDB02  [project net HDB.HDB02]
HDB03: J7.D48 ; port HDB.HDB03  [project net HDB.HDB03]
HDB04: J7.D49 ; port HDB.HDB04  [project net HDB.HDB04]
HDB05: J7.D50 ; port HDB.HDB05  [project net HDB.HDB05]
HDB06: J7.C46 ; port HDB.HDB06  [project net HDB.HDB06]
HDB07: J7.C47 ; port HDB.HDB07  [project net HDB.HDB07]
HDB08_CC: J7.C48 ; port HDB.HDB08_CC  [project net HDB.HDB08_CC]
HDB09: J7.C50 ; port HDB.HDB09  [project net HDB.HDB09]
HDB10: J7.C51 ; port HDB.HDB10  [project net HDB.HDB10]
HDB11: J7.C52 ; port HDB.HDB11  [project net HDB.HDB11]
HDB12: J7.B44 ; port HDB.HDB12  [project net HDB.HDB12]
HDB13: J7.B45 ; port HDB.HDB13  [project net HDB.HDB13]
HDB14: J7.B46 ; port HDB.HDB14  [project net HDB.HDB14]
HDB15: J7.B48 ; port HDB.HDB15  [project net HDB.HDB15]
HDB16_CC: J7.B49 ; port HDB.HDB16_CC  [project net HDB.HDB16_CC]
HDB17: J7.B50 ; port HDB.HDB17  [project net HDB.HDB17]
HDB18: J7.A46 ; port HDB.HDB18  [project net HDB.HDB18]
HDB19: J7.A47 ; port HDB.HDB19  [project net HDB.HDB19]
HDB20: J7.A48 ; port HDB.HDB20  [project net HDB.HDB20]
HDB21: J7.A50 ; port HDB.HDB21  [project net HDB.HDB21]
HDB22: J7.A51 ; port HDB.HDB22  [project net HDB.HDB22]
HDB23: J7.A52 ; port HDB.HDB23  [project net HDB.HDB23]
HDC00_CC: J7.D52 ; port HDC.HDC00_CC
HDC01: J7.D53 ; port HDC.HDC01
HDC02: J7.D54 ; port HDC.HDC02
HDC03: J7.D56 ; port HDC.HDC03
HDC04: J7.D57 ; port HDC.HDC04
HDC05: J7.D58 ; port HDC.HDC05
HDC06: J7.C54 ; port HDC.HDC06
HDC07: J7.C55 ; port HDC.HDC07
HDC08_CC: J7.C56 ; port HDC.HDC08_CC
HDC09: J7.C58 ; port HDC.HDC09
HDC10: J7.C59 ; port HDC.HDC10
HDC11: J7.C60 ; port HDC.HDC11
HDC12: J7.B52 ; port HDC.HDC12
HDC13: J7.B53 ; port HDC.HDC13
HDC14: J7.B54 ; port HDC.HDC14
HDC15: J7.B56 ; port HDC.HDC15
HDC16_CC: J7.B57 ; port HDC.HDC16_CC
HDC17: J7.B58 ; port HDC.HDC17
HDC18: J7.A54 ; port HDC.HDC18
HDC19: J7.A55 ; port HDC.HDC19
HDC20: J7.A56 ; port HDC.HDC20
HDC21: J7.A58 ; port HDC.HDC21
HDC22: J7.A59 ; port HDC.HDC22
HDC23: J7.A60 ; port HDC.HDC23
HPB00_CC_N: J7.D16 ; port HPB_0-7.HPB00_CC_N  [project net EXT3.LVDS_N0]
HPB00_CC_P: J7.D15 ; port HPB_0-7.HPB00_CC_P  [project net EXT3.LVDS_P0]
HPB01_N: J7.D13 ; port HPB_0-7.HPB01_N  [project net EXT3.LVDS_N1]
HPB01_P: J7.D12 ; port HPB_0-7.HPB01_P  [project net EXT3.LVDS_P1]
HPB02_N: J7.C18 ; port HPB_0-7.HPB02_N  [project net EXT3.LVDS_N2]
HPB02_P: J7.C17 ; port HPB_0-7.HPB02_P  [project net EXT3.LVDS_P2]
HPB03_N: J7.B25 ; port HPB_0-7.HPB03_N  [project net EXT3.LVDS_N3]
HPB03_P: J7.B24 ; port HPB_0-7.HPB03_P  [project net EXT3.LVDS_P3]
HPB04_N: J7.D22 ; port HPB_0-7.HPB04_N  [project net EXT3.LVDS_N4]
HPB04_P: J7.D21 ; port HPB_0-7.HPB04_P  [project net EXT3.LVDS_P4]
HPB05_CC_N: J7.B19 ; port HPB_0-7.HPB05_CC_N  [project net EXT3.LVDS_N5]
HPB05_CC_P: J7.B18 ; port HPB_0-7.HPB05_CC_P  [project net EXT3.LVDS_P5]
HPB06_N: J7.A21 ; port HPB_0-7.HPB06_N  [project net EXT3.LVDS_N6]
HPB06_P: J7.A20 ; port HPB_0-7.HPB06_P  [project net EXT3.LVDS_P6]
HPB07_N: J7.B16 ; port HPB_0-7.HPB07_N  [project net EXT3.LVDS_N7]
HPB07_P: J7.B15 ; port HPB_0-7.HPB07_P  [project net EXT3.LVDS_P7]
HPB08_N: J7.A15 ; port HPB_8-19.HPB08_N
HPB08_P: J7.A14 ; port HPB_8-19.HPB08_P
HPB09_N: J7.C12 ; port HPB_8-19.HPB09_N
HPB09_P: J7.C11 ; port HPB_8-19.HPB09_P
HPB10_CC_N: J7.B13 ; port HPB_8-19.HPB10_CC_N
HPB10_CC_P: J7.B12 ; port HPB_8-19.HPB10_CC_P
HPB11_N: J7.B22 ; port HPB_8-19.HPB11_N
HPB11_P: J7.B21 ; port HPB_8-19.HPB11_P
HPB12_N: J7.A18 ; port HPB_8-19.HPB12_N
HPB12_P: J7.A17 ; port HPB_8-19.HPB12_P
HPB13_N: J7.C21 ; port HPB_8-19.HPB13_N
HPB13_P: J7.C20 ; port HPB_8-19.HPB13_P
HPB14_N: J7.C15 ; port HPB_8-19.HPB14_N
HPB14_P: J7.C14 ; port HPB_8-19.HPB14_P
HPB15_CC_N: J7.A12 ; port HPB_8-19.HPB15_CC_N
HPB15_CC_P: J7.A11 ; port HPB_8-19.HPB15_CC_P
HPB16_N: J7.A24 ; port HPB_8-19.HPB16_N
HPB16_P: J7.A23 ; port HPB_8-19.HPB16_P
HPB17_N: J7.D25 ; port HPB_8-19.HPB17_N
HPB17_P: J7.D24 ; port HPB_8-19.HPB17_P
HPB18_N: J7.C24 ; port HPB_8-19.HPB18_N
HPB18_P: J7.C23 ; port HPB_8-19.HPB18_P
HPB19_N: J7.A27 ; port HPB_8-19.HPB19_N
HPB19_P: J7.A26 ; port HPB_8-19.HPB19_P
HPB_CLK0_N: J7.D19 ; port HPB_0-7.HPB_CLK0_N  [project net HPB_0-7.HPB_CLK0_N]
HPB_CLK0_P: J7.D18 ; port HPB_0-7.HPB_CLK0_P  [project net HPB_0-7.HPB_CLK0_P]
HPC00_CC_N: J7.D34 ; port HPC_0-7.HPC00_CC_N
HPC00_CC_P: J7.D33 ; port HPC_0-7.HPC00_CC_P
HPC01_N: J7.D31 ; port HPC_0-7.HPC01_N
HPC01_P: J7.D30 ; port HPC_0-7.HPC01_P
HPC02_N: J7.D37 ; port HPC_0-7.HPC02_N
HPC02_P: J7.D36 ; port HPC_0-7.HPC02_P
HPC03_N: J7.A42 ; port HPC_0-7.HPC03_N
HPC03_P: J7.A41 ; port HPC_0-7.HPC03_P
HPC04_N: J7.D40 ; port HPC_0-7.HPC04_N
HPC04_P: J7.D39 ; port HPC_0-7.HPC04_P
HPC05_CC_N: J7.C39 ; port HPC_0-7.HPC05_CC_N
HPC05_CC_P: J7.C38 ; port HPC_0-7.HPC05_CC_P
HPC06_N: J7.B28 ; port HPC_0-7.HPC06_N
HPC06_P: J7.B27 ; port HPC_0-7.HPC06_P
HPC07_N: J7.B37 ; port HPC_0-7.HPC07_N
HPC07_P: J7.B36 ; port HPC_0-7.HPC07_P
HPC08_N: J7.A30 ; port HPC_8-19.HPC08_N
HPC08_P: J7.A29 ; port HPC_8-19.HPC08_P
HPC09_N: J7.D28 ; port HPC_8-19.HPC09_N
HPC09_P: J7.D27 ; port HPC_8-19.HPC09_P
HPC10_CC_N: J7.C30 ; port HPC_8-19.HPC10_CC_N
HPC10_CC_P: J7.C29 ; port HPC_8-19.HPC10_CC_P
HPC11_N: J7.C33 ; port HPC_8-19.HPC11_N
HPC11_P: J7.C32 ; port HPC_8-19.HPC11_P
HPC12_N: J7.C36 ; port HPC_8-19.HPC12_N
HPC12_P: J7.C35 ; port HPC_8-19.HPC12_P
HPC13_N: J7.B31 ; port HPC_8-19.HPC13_N
HPC13_P: J7.B30 ; port HPC_8-19.HPC13_P
HPC14_N: J7.A36 ; port HPC_8-19.HPC14_N
HPC14_P: J7.A35 ; port HPC_8-19.HPC14_P
HPC15_CC_N: J7.A39 ; port HPC_8-19.HPC15_CC_N
HPC15_CC_P: J7.A38 ; port HPC_8-19.HPC15_CC_P
HPC16_N: J7.B34 ; port HPC_8-19.HPC16_N
HPC16_P: J7.B33 ; port HPC_8-19.HPC16_P
HPC17_N: J7.C27 ; port HPC_8-19.HPC17_N
HPC17_P: J7.C26 ; port HPC_8-19.HPC17_P
HPC18_N: J7.B40 ; port HPC_8-19.HPC18_N
HPC18_P: J7.B39 ; port HPC_8-19.HPC18_P
HPC19_N: J7.A33 ; port HPC_8-19.HPC19_N
HPC19_P: J7.A32 ; port HPC_8-19.HPC19_P
HPC_CLK0_N: J7.C42 ; port HPC_0-7.HPC_CLK0_N
HPC_CLK0_P: J7.C41 ; port HPC_0-7.HPC_CLK0_P

### Layout directives
differential pair; differential pair class Diff_GTH: GTH_CLK.GTH_REFCLK0_N, GTH_CLK.GTH_REFCLK0_P, GTH_CLK.GTH_REFCLK1_N, GTH_CLK.GTH_REFCLK1_P, GTH_DATA.GTH_DP0_C2M_N, GTH_DATA.GTH_DP0_C2M_P, GTH_DATA.GTH_DP0_M2C_N, GTH_DATA.GTH_DP0_M2C_P, GTH_DATA.GTH_DP1_C2M_N, GTH_DATA.GTH_DP1_C2M_P, GTH_DATA.GTH_DP1_M2C_N, GTH_DATA.GTH_DP1_M2C_P, GTH_DATA.GTH_DP2_C2M_N, GTH_DATA.GTH_DP2_C2M_P, GTH_DATA.GTH_DP2_M2C_N, GTH_DATA.GTH_DP2_M2C_P, GTH_DATA.GTH_DP3_C2M_N, GTH_DATA.GTH_DP3_C2M_P, GTH_DATA.GTH_DP3_M2C_N, GTH_DATA.GTH_DP3_M2C_P
differential pair; differential pair class Diff_HPB: EXT3.LVDS_N0, EXT3.LVDS_N1, EXT3.LVDS_N2, EXT3.LVDS_N3, EXT3.LVDS_N4, EXT3.LVDS_N5, EXT3.LVDS_N6, EXT3.LVDS_N7, EXT3.LVDS_P0, EXT3.LVDS_P1, EXT3.LVDS_P2, EXT3.LVDS_P3, EXT3.LVDS_P4, EXT3.LVDS_P5, EXT3.LVDS_P6, EXT3.LVDS_P7, HPB08_N, HPB08_P, HPB09_N, HPB09_P, HPB10_CC_N, HPB10_CC_P, HPB11_N, HPB11_P, HPB12_N, HPB12_P, HPB13_N, HPB13_P, HPB14_N, HPB14_P, HPB15_CC_N, HPB15_CC_P, HPB16_N, HPB16_P, HPB17_N, HPB17_P, HPB18_N, HPB18_P, HPB19_N, HPB19_P, HPB_0-7.HPB_CLK0_N, HPB_0-7.HPB_CLK0_P
differential pair; differential pair class Diff_HPC: HPC00_CC_N, HPC00_CC_P, HPC01_N, HPC01_P, HPC02_N, HPC02_P, HPC03_N, HPC03_P, HPC04_N, HPC04_P, HPC05_CC_N, HPC05_CC_P, HPC06_N, HPC06_P, HPC07_N, HPC07_P, HPC08_N, HPC08_P, HPC09_N, HPC09_P, HPC10_CC_N, HPC10_CC_P, HPC11_N, HPC11_P, HPC12_N, HPC12_P, HPC13_N, HPC13_P, HPC14_N, HPC14_P, HPC15_CC_N, HPC15_CC_P, HPC16_N, HPC16_P, HPC17_N, HPC17_P, HPC18_N, HPC18_P, HPC19_N, HPC19_P, HPC_CLK0_N, HPC_CLK0_P

### Notes on the sheet
- Connector used by K26
- Internally AC coupled
- VCCO_HDB
- VCCO_HPB
- VCCO_HPC
- Project/Equipment
- Document
- Designer
- Drawn by
- Check.by
- Copyright WUT ISE 2020.
  This documentation describes Open Hardware and is licensed under the CERN OHL v.1.2. You may redistribute and modify this documentation under the terms of the CERN OHL v.1.2. (http://ohwr.org/CERNOHL). This documentation is distributed WITHOUT ANY EXPRESS OR IMPLIED WARRANTY, INCLUDING OF MERCHANTABILITY, SATISFACTORY QUALITY AND FITNESS FOR A PARTICULAR PURPOSE. Please see the CERN OHL v.1.2 for applicable conditions.
- Contact
- File
- Last Mod.
- Print Date
- Sheet
- Size
- A3
- of
- Rev

### Library data of the parts
C81 C83 C85 = CC0402_1UF_16V_10%_X5R: as C74 on sheet Connector_SOM240_1; Part Number: CC0402_1UF_16V_10%_X5R; Component Kind: Standard; Component Type: Standard; Pin Count: 2; Value: 1uF; Status: Preferred; Manufacturer Part Number: CC0402_1UF_16V_10%_X5R; Case: 0402; Mounted: Yes; Socket: No; SMD: Yes; Sense: No; Manufacturer1 Example: TDK; Manufacturer1 ComponentHeight: 0.55mm; HelpURL: \\cern.ch\dfs\Applications\Altium\Datasheets\CC0402_X5R_TDK_C.pdf; Author: CERN DEM JLC; CreateDate: 2012-10-25; LatestRevisionDate: 2012-10-25
C82 C84 C86 = CC0402_100NF_16V_10%_X5R: as C75 on sheet Connector_SOM240_1; Part Number: CC0402_100NF_16V_10%_X5R; Component Kind: Standard; Component Type: Standard; Pin Count: 2; Value: 100nF; Status: None; Manufacturer Part Number: CC0402_100NF_16V_10%_X5R; Case: 0402; Mounted: Yes; Socket: No; SMD: Yes; Sense: No; Manufacturer1 Example: MURATA; Manufacturer1 ComponentHeight: 0.55mm; HelpURL: \\cern.ch\dfs\Applications\Altium\Datasheets\CC0402_X5R_MURATA_GRM.pdf; Author: CERN DEM JLC; CreateDate: 10.12.2013; LatestRevisionDate: 10.12.2013
J7 = SAMTEC_ADM6-60-01.5-L-4-2-A: as J5 on sheet Connector_SOM240_1; Part Number: SAMTEC_ADM6-60-01.5-L-4-2-A; Component Kind: Standard; Component Type: Standard; Pin Count: 240; Family: Header 240; Mounted: Yes; Socket: No; SMD: Yes; Sense: No; Status: None; ComponentHeight: 4.1mm; HelpURL: \\cern.ch\dfs\Applications\Altium\Datasheets\SAMTEC_ADM6-60-01.5-L-4-2-A.pdf; Author: CERN DEM HF; CreateDate: 27/10/2021; LatestRevisionDate: 11/01/2022

## Sheet Connector_SOM40.SchDoc: =SheetTitle_Top
size 420 x 297 mm; EDA_Number: ARTIQ; Projet: Simple EEM Controller; Author: G.Kasprowicz; CompanyName: WUT ISE; DrawnBy: G.Kasprowicz; Organization: WUT ISE; Address1: PW ISE; Address2: Nowowiejska 15/19 00-665 Warsaw; Address3: gkasprow@gmail.com; Revision: 1.0; ModifiedBy: -; CheckedDate: -; Title2: K24 SOM40 Connector; DivGrp: WUT ISE; Designer: G.Kasprowicz; ModifiedDate: -; ProjectName: Sensor Box
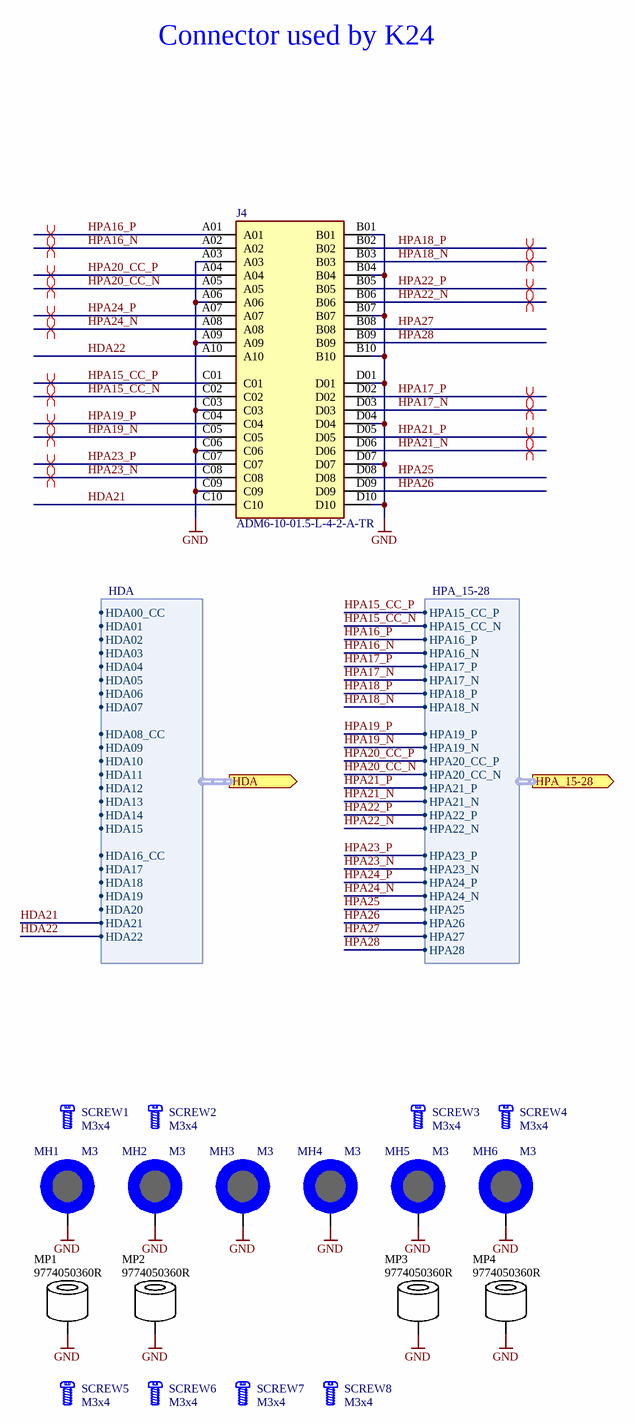
[diagram p7: Connector_SOM40.SchDoc]

### Parts
J4  ADM6-10-01.5-L-4-2-A-TR  [SAMTEC_ADM6-10-01.5-L-4-2-A-TR]
MH1  M3  [MH-M3_COPPER]  (no BOM)
MH2  M3  [MH-M3_COPPER]  (no BOM)
MH3  M3  [MH-M3_COPPER]  (no BOM)
MH4  M3  [MH-M3_COPPER]  (no BOM)
MH5  M3  [MH-M3_COPPER]  (no BOM)
MH6  M3  [MH-M3_COPPER]  (no BOM)
MP1  9774050360R  [9774050960R]
MP2  9774050360R  [9774050960R]
MP3  9774050360R  [9774050960R]
MP4  9774050360R  [9774050960R]
SCREW1  M3x4  [KRAFTBERG_M3X4/ISO7380-1-A2-K26]
SCREW2  M3x4  [KRAFTBERG_M3X4/ISO7380-1-A2-K26]
SCREW3  M3x4  [KRAFTBERG_M3X4/ISO7380-1-A2-K26]
SCREW4  M3x4  [KRAFTBERG_M3X4/ISO7380-1-A2-K26]
SCREW5  M3x4  [KRAFTBERG_M3X4/ISO7380-1-A2-K24]
SCREW6  M3x4  [KRAFTBERG_M3X4/ISO7380-1-A2-K24]
SCREW7  M3x4  [KRAFTBERG_M3X4/ISO7380-1-A2-K24]
SCREW8  M3x4  [KRAFTBERG_M3X4/ISO7380-1-A2-K24]

### Ports
HDA (out, harness HDA), HPA_15-28 (out, harness HPA_15-28)

### Harnesses
HPA_15-28: HPA15_CC_P, HPA15_CC_N, HPA16_P, HPA16_N, HPA17_P, HPA17_N, HPA18_P, HPA18_N, HPA19_P, HPA19_N, HPA20_CC_P, HPA20_CC_N, HPA21_P, HPA21_N, HPA22_P, HPA22_N, HPA23_P, HPA23_N, HPA24_P, HPA24_N, HPA25, HPA26, HPA27, HPA28
HDA: HDA00_CC, HDA01, HDA02, HDA03, HDA04, HDA06, HDA07, HDA05, HDA08_CC, HDA09, HDA10, HDA11, HDA12, HDA13, HDA14, HDA15, HDA16_CC, HDA17, HDA18, HDA19, HDA20, HDA21, HDA22

### Nets
GND: J4.A03 J4.A06 J4.A09 J4.B01 J4.B04 J4.B07 J4.B10 J4.C03 J4.C06 J4.C09 J4.D01 J4.D04 J4.D07 J4.D10 MH1.MH MH2.MH MH3.MH MH4.MH MH5.MH MH6.MH MP1.1 MP2.1 MP3.1 MP4.1
HDA21: J4.C10 ; port HDA.HDA21  [project net HDA.HDA21]
HDA22: J4.A10 ; port HDA.HDA22  [project net HDA.HDA22]
HPA15_CC_N: J4.C02 ; port HPA_15-28.HPA15_CC_N
HPA15_CC_P: J4.C01 ; port HPA_15-28.HPA15_CC_P
HPA16_N: J4.A02 ; port HPA_15-28.HPA16_N
HPA16_P: J4.A01 ; port HPA_15-28.HPA16_P
HPA17_N: J4.D03 ; port HPA_15-28.HPA17_N
HPA17_P: J4.D02 ; port HPA_15-28.HPA17_P
HPA18_N: J4.B03 ; port HPA_15-28.HPA18_N
HPA18_P: J4.B02 ; port HPA_15-28.HPA18_P
HPA19_N: J4.C05 ; port HPA_15-28.HPA19_N
HPA19_P: J4.C04 ; port HPA_15-28.HPA19_P
HPA20_CC_N: J4.A05 ; port HPA_15-28.HPA20_CC_N
HPA20_CC_P: J4.A04 ; port HPA_15-28.HPA20_CC_P
HPA21_N: J4.D06 ; port HPA_15-28.HPA21_N
HPA21_P: J4.D05 ; port HPA_15-28.HPA21_P
HPA22_N: J4.B06 ; port HPA_15-28.HPA22_N
HPA22_P: J4.B05 ; port HPA_15-28.HPA22_P
HPA23_N: J4.C08 ; port HPA_15-28.HPA23_N
HPA23_P: J4.C07 ; port HPA_15-28.HPA23_P
HPA24_N: J4.A08 ; port HPA_15-28.HPA24_N
HPA24_P: J4.A07 ; port HPA_15-28.HPA24_P
HPA25: J4.D08 ; port HPA_15-28.HPA25
HPA26: J4.D09 ; port HPA_15-28.HPA26
HPA27: J4.B08 ; port HPA_15-28.HPA27
HPA28: J4.B09 ; port HPA_15-28.HPA28

### Layout directives
differential pair; differential pair class Diff_HPC: HPA15_CC_N, HPA15_CC_P, HPA16_N, HPA16_P, HPA17_N, HPA17_P, HPA18_N, HPA18_P, HPA19_N, HPA19_P, HPA20_CC_N, HPA20_CC_P, HPA21_N, HPA21_P, HPA22_N, HPA22_P, HPA23_N, HPA23_P, HPA24_N, HPA24_P

### Notes on the sheet
- Connector used by K24
- Project/Equipment
- Document
- Designer
- Drawn by
- Check.by
- Copyright WUT ISE 2020.
  This documentation describes Open Hardware and is licensed under the CERN OHL v.1.2. You may redistribute and modify this documentation under the terms of the CERN OHL v.1.2. (http://ohwr.org/CERNOHL). This documentation is distributed WITHOUT ANY EXPRESS OR IMPLIED WARRANTY, INCLUDING OF MERCHANTABILITY, SATISFACTORY QUALITY AND FITNESS FOR A PARTICULAR PURPOSE. Please see the CERN OHL v.1.2 for applicable conditions.
- Contact
- File
- Last Mod.
- Print Date
- Sheet
- Size
- A3
- of
- Rev

### Library data of the parts
J4 = ADM6-10-01.5-L-4-2-A-TR: Manufacturer: Samtec; Part Number: ADM6-10-01.5-L-4-2-A-TR
MH1-MH6 = MH-M3_C: Mounting hole, M3, exposed pad; DesignItemId: MH-M3_C; Author: KB; Family: M3; Part Description: Mounting hole, M3, exposed pad; Create Date: 11/05/2019; LatestRevisionDate: 11/05/2019
MP1-MP4 = 9774050960R: MP; Manufacturer: Würth Elektronik; Part Number: 9774050360R
SCREW1-SCREW8 = Screw: Part Number: KRAFTBERG_M3X4/ISO7380-1-A2; Part Description: M3 L=4mm Hexalobular Socket Pan Head Screw, Fully Threaded, Stainless Steel A2; Manufacturer: KRAFTBERG; Manufacturer Part Number: M3X4/ISO7380-1-A2; PressFit: No; Component Kind: Standard; Component Type: Mechanical; Footprint: KRAFTBERG_M3X4/ISO7380-1-A2; Pin Count: 0; PackageDescription: M3 L=4mm Hexalobular Socket Pan Head Screw, Fully Threaded - Stainless Steel A2; Mounted: Yes; Socket: No; SMD: No; Sense: No; Status: None; Value: M3x4; ComponentHeight: 5.65mm; HelpURL: \\cern.ch\dfs\Applications\Altium\Datasheets\BOSSARD_BN5687-3061605.pdf; Author: CERN DEM JLC; CreateDate: 15/01/2013; LatestRevisionDate: 15/01/2013